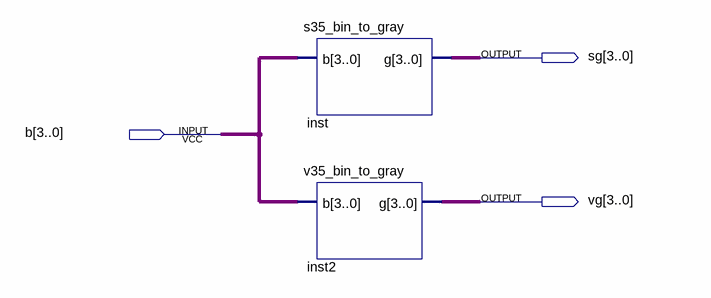
[diagram p0: schematic sheet]
// Quartus schematic sv35_bin_to_gray.bdf as structural Verilog: 2 symbols, 3 pins
module sv35_bin_to_gray (
  input  [3:0] b,
  output [3:0] sg,
  output [3:0] vg
);

  s35_bin_to_gray inst (.b(b), .g(sg));
  v35_bin_to_gray inst2 (.b(b), .g(vg));
endmodule
